# Altium schematic sheet ETH_HMI.SchDoc
size A3
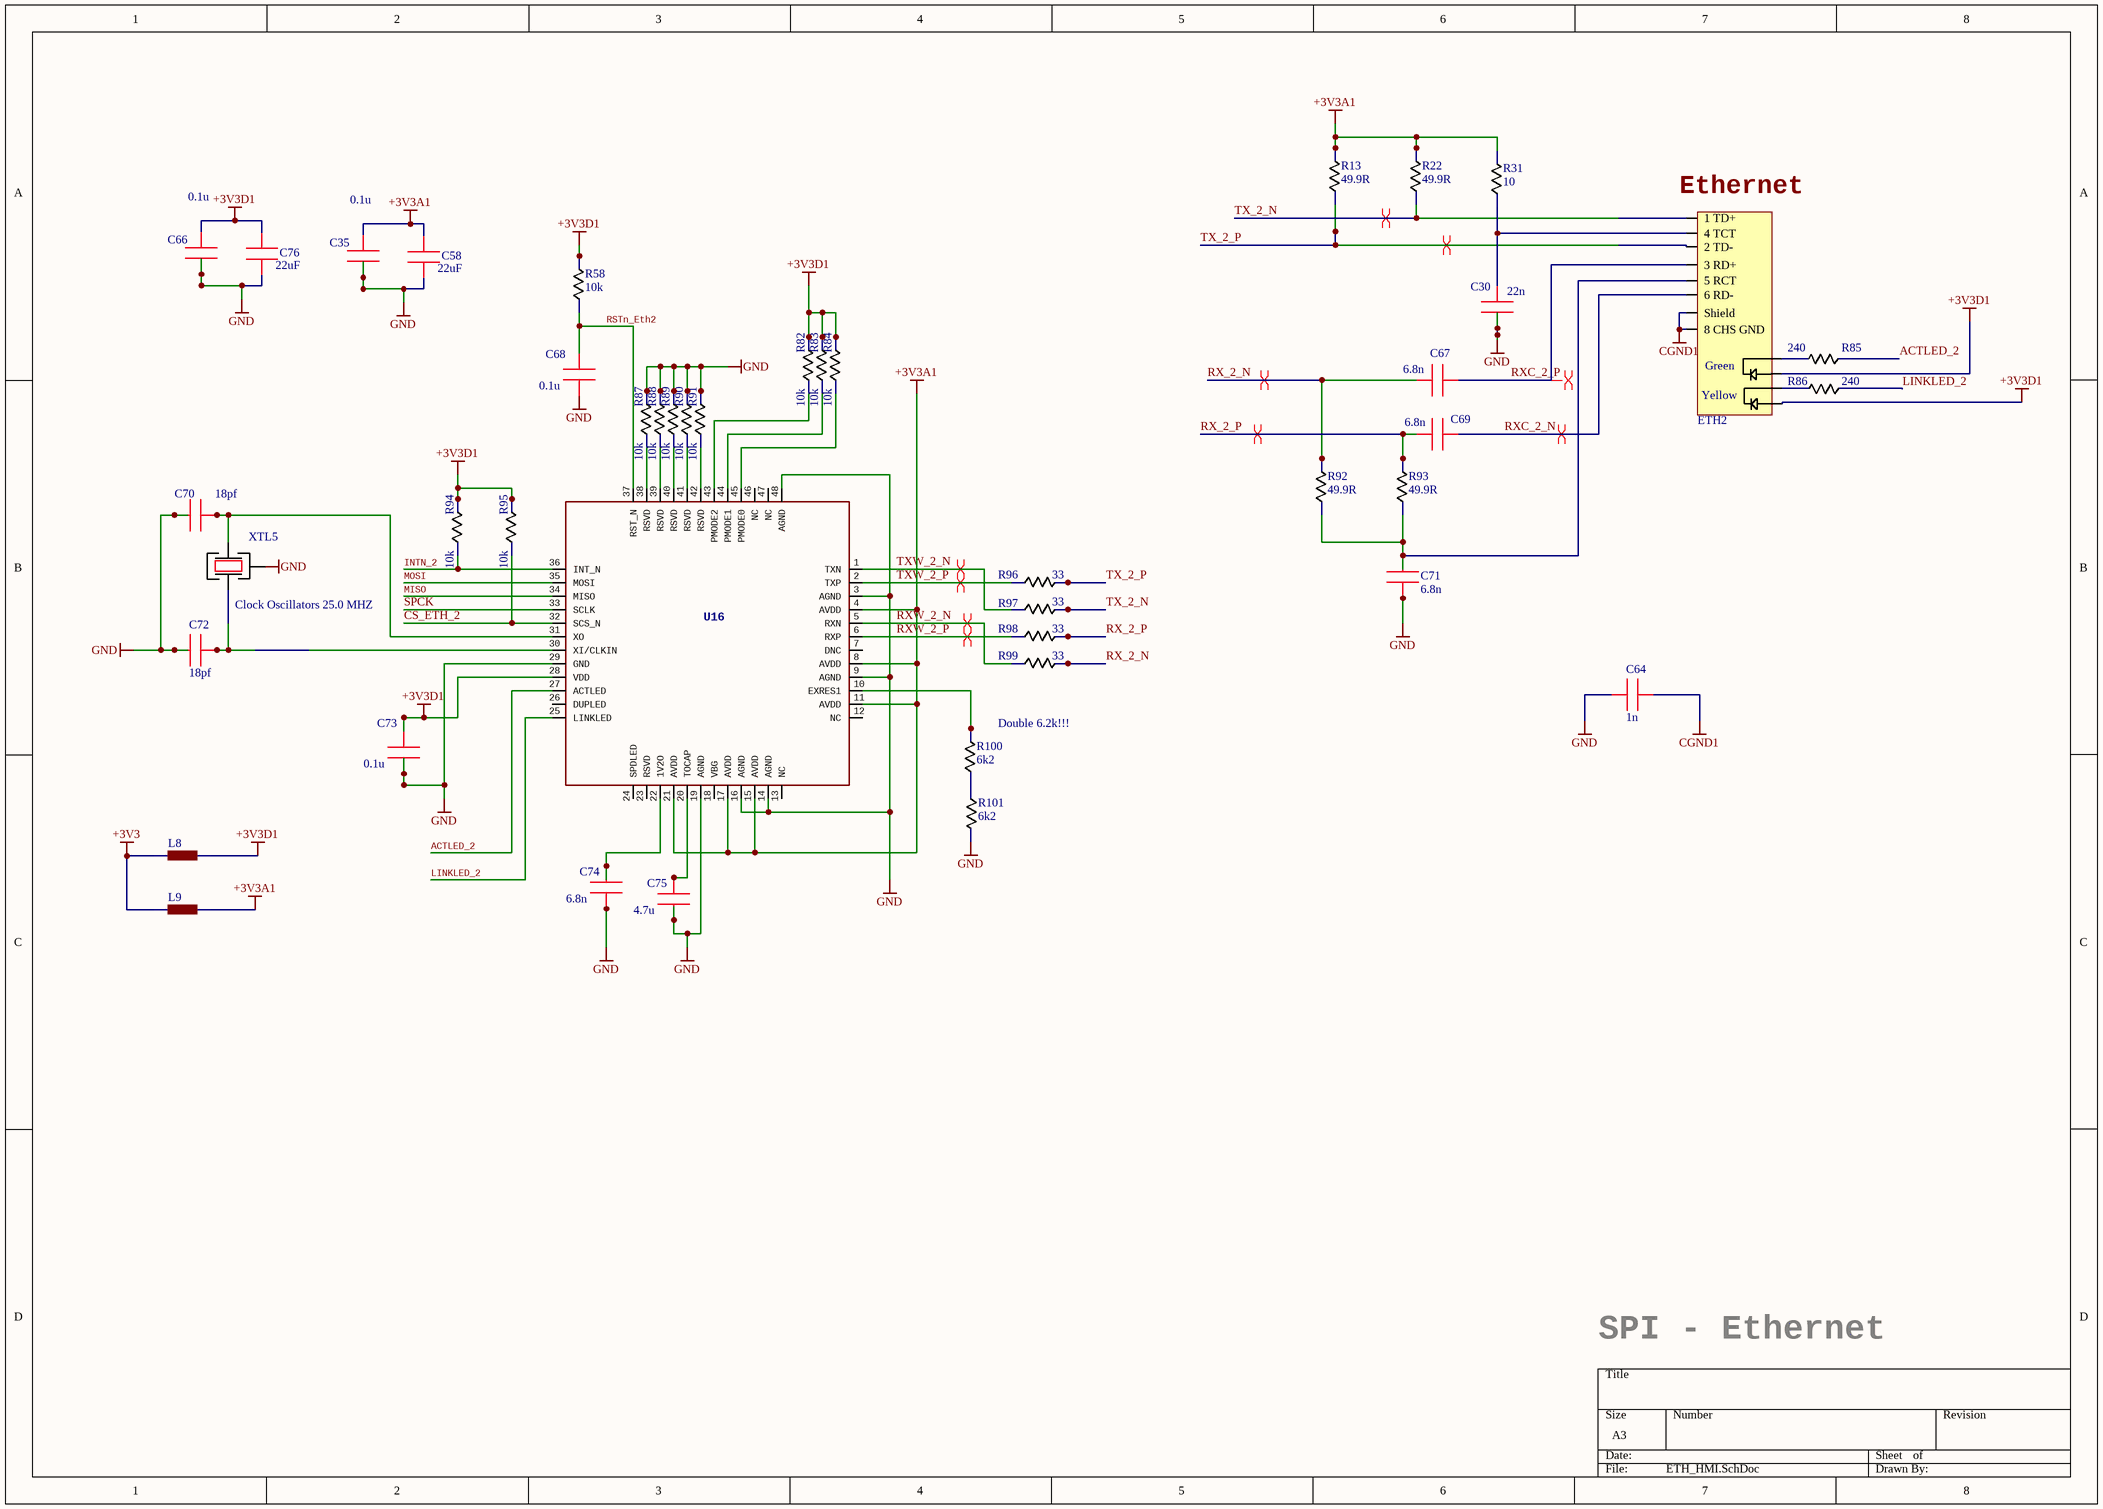
[diagram p0: ETH_HMI.SchDoc]

## Parts
C30  22n  [0603]
C35  0.1u  [0603]
C58  22uF  [1206]
C64  1n  [1206]
C66  0.1u  [0603]
C67  6.8n  [0603]
C68  0.1u  [0603]
C69  6.8n  [0603]
C70  18pf  [0603]
C71  6.8n  [0603]
C72  18pf  [0603]
C73  0.1u  [0603]
C74  6.8n  [0603]
C75  4.7u  [0603]
C76  22uF  [1206]
ETH2  (no value)  [RJ45]
L8  (no value)  [0805]
L9  (no value)  [0805]
R13  49.9R  [0603]
R22  49.9R  [0603]
R31  10  [0603]
R58  10k  [0603]
R82  10k  [0603]
R83  10k  [0603]
R84  10k  [0603]
R85  240  [0603]
R86  240  [0603]
R87  10k  [0603]
R88  10k  [0603]
R89  10k  [0603]
R90  10k  [0603]
R91  10k  [0603]
R92  49.9R  [0603]
R93  49.9R  [0603]
R94  10k  [0603]
R95  10k  [0603]
R96  33  [0603]
R97  33  [0603]
R98  33  [0603]
R99  33  [0603]
R100  6k2  [0603]
R101  6k2  [0603]
U16  (no value)  [LQFP 48]
XTL5  Part Description: Clock Oscillators 25.0 MHZ  [KX-7 XTAL]

## Nets
+3V3: L8.1 L9.1
+3V3A1: C35.1 C58.2 L9.2 R13.2 R22.2 R31.2 U16.4(AVDD) U16.8(AVDD) U16.11(AVDD) U16.15(AVDD) U16.17(AVDD) U16.21(AVDD)
+3V3D1: C66.1 C73.1 C76.2 ETH2.9(LDGr) ETH2.12(LDYE) L8.2 R58.2 R82.2 R83.2 R84.2 R94.2 R95.2 U16.28(VDD)
CGND1: C64.2 ETH2.8(8_CHS_GND) ETH2.SHIELD(Shield)
GND: C30.2 C35.2 C58.1 C64.1 C66.2 C68.2 C70.1 C71.2 C72.1 C73.2 C74.2 C75.2 C76.1 R87.2 R88.2 R89.2 R90.2 R91.2 R101.2 U16.3(AGND) U16.9(AGND) U16.14(AGND) U16.16(AGND) U16.19(AGND) U16.29(GND) U16.48(AGND) XTL5.2
ACTLED_2: R85.1 U16.27(ACTLED)
CS_ETH_2: R95.1 U16.32(SCS_N)
INTN_2: R94.1 U16.36(INT_N)
LINKLED_2: R86.1 U16.25(LINKLED)
MISO: U16.34(MISO)
MOSI: U16.35(MOSI)
RSTn_Eth2: C68.1 R58.1 U16.37(RST_N)
RX_2_N: C67.1 R92.2 R99.2
RX_2_P: C69.1 R93.2 R98.2
RXC_2_N: C69.2 ETH2.6(6_RD-)
RXC_2_P: C67.2 ETH2.3(3_RD+)
RXW_2_N: R99.1 U16.5(RXN)
RXW_2_P: R98.1 U16.6(RXP)
SPCK: U16.33(SCLK)
TX_2_N: ETH2.1(1_TD+) R22.1 R97.2
TX_2_P: ETH2.2(2_TD-) R13.1 R96.2
TXW_2_N: R97.1 U16.1(TXN)
TXW_2_P: R96.1 U16.2(TXP)
NetC30_1: C30.1 ETH2.4(4_TCT) R31.1
NetC70_2: C70.2 U16.31(XO) XTL5.3
NetC71_1: C71.1 ETH2.5(5_RCT) R92.1 R93.1
NetC72_2: C72.2 U16.30(XI/CLKIN) XTL5.1
NetC74_1: C74.1 U16.22(1V2O)
NetC75_1: C75.1 U16.20(TOCAP)
NetETH2_10: ETH2.10(LDGr) R85.2
NetETH2_11: ETH2.11(LDYE) R86.2
NetR82_1: R82.1 U16.43(PMODE2)
NetR83_1: R83.1 U16.44(PMODE1)
NetR84_1: R84.1 U16.45(PMODE0)
NetR87_1: R87.1 U16.38(RSVD)
NetR88_1: R88.1 U16.39(RSVD)
NetR89_1: R89.1 U16.40(RSVD)
NetR90_1: R90.1 U16.41(RSVD)
NetR91_1: R91.1 U16.42(RSVD)
NetR100_1: R100.1 R101.1
NetR100_2: R100.2 U16.10(EXRES1)

Not connected (* = marked no-connect by the designer): U16 7(DNC) 12(NC) 13(NC) 18(VBG) 23(RSVD) 24(SPDLED) 26(DUPLED) 46(NC) 47(NC)

## Layout directives
differential pair: RX_2_N, RX_2_P, RXC_2_N, RXC_2_P, RXW_2_N, RXW_2_P, TX_2_N, TX_2_P, TXW_2_N, TXW_2_P

## Notes on the sheet
- (near ETH2) Ethernet
- (near R100) Double 6.2k!!!
- SPI - Ethernet
- (in symbol J0011D21BNL) Green; Yellow

## Library data of the parts
C30 = 0603 CAP: Part Description: 0.022UF 50V 10% 0603; Part Number: GRM188R71H223KA01D
C35 C66 C68 C73 = 0603 CAP: Part Description: 0.1 uF 100 VDC 10% 0603 X7R; Part Number: GRM188R72A104KA35D
C58 C76 = 0805 Cap: Part Description: 16V 22uF X5R 1206 10%; Part Number: CC206KKX5R7BB226
C64 = 0603 CAP: Part Description: 2kV 1000pF X7R 1206 10%; Part Number: CC1206KKX7RDBB102
C67 C69 C71 C74 = 0603 CAP: Part Description: 50V 6800pF X7R 0603 10%; Part Number: CC0603KRX7R9BB682
C70 C72 = 0603 CAP: Part Description: 18 pF 50 VDC 5% 0603 C0G; Part Number: GRM1885C1H180JA01D
C75 = 0603 CAP: Part Description: 16V 4.7uF X5R 0603 10%; Part Number: CC0603KRX5R7BB475
ETH2 = J0011D21BNL: Part Description: RJ45 MagJack; Part Number: J0011D21BNL
L8 L9 = BLM21PG220SN1D: Part Description: Ferrite Beads 1000 OHM 25%  100 MHz; Part Number: BLM41PG102SN1L
R13 R22 R92 R93 = 0603 RES: Part Description: Resistor 0603, 49.9Ohms, 1%, 1/10W; Part Number: RC0603FR-0749R9
R31 = 0603 RES: Part Description: Resistors - 1/8 Watt 10ohms 1%; Part Number: CRCW060310R0FKEA
R58 R82-R84 R87-R91 R94 R95 = 0603 RES: Part Description: Resistor 0603, 10kOhms, 5%, 1/10W; Part Number: RC0603JR-0710K
R85 R86 = 0603 RES: Part Description: Resistor 0603, 240Ohms, 1%, 1/10W; Part Number: RC0603FR-07240RL
R96-R99 = 0603 RES: Part Description: Resistor 0603, 33Ohms, 1%, 1/10W; Part Number: RC0603FR-0733RL
R100 = 0603 RES: Part Description: Resistor 0603, 6.2kOhms, 5%, 1/10W; Part Number: RC0603JR-076K2L
R101 = Resistor 0805: Part Description: Resistor 0603, 6.2kOhms, 5%, 1/10W; Part Number: RC0603JR-076K2L
U16 = W5500: Part Description: Ethernet ICs 3in1 Enet Controller TCP/IP +MAC+PHY; Part Number: W5500
XTL5 = KX-7: Part Number: Geyer KX-7 25.0 MHz